# EAGLE schematic untitled (EAGLE 6.5.0)
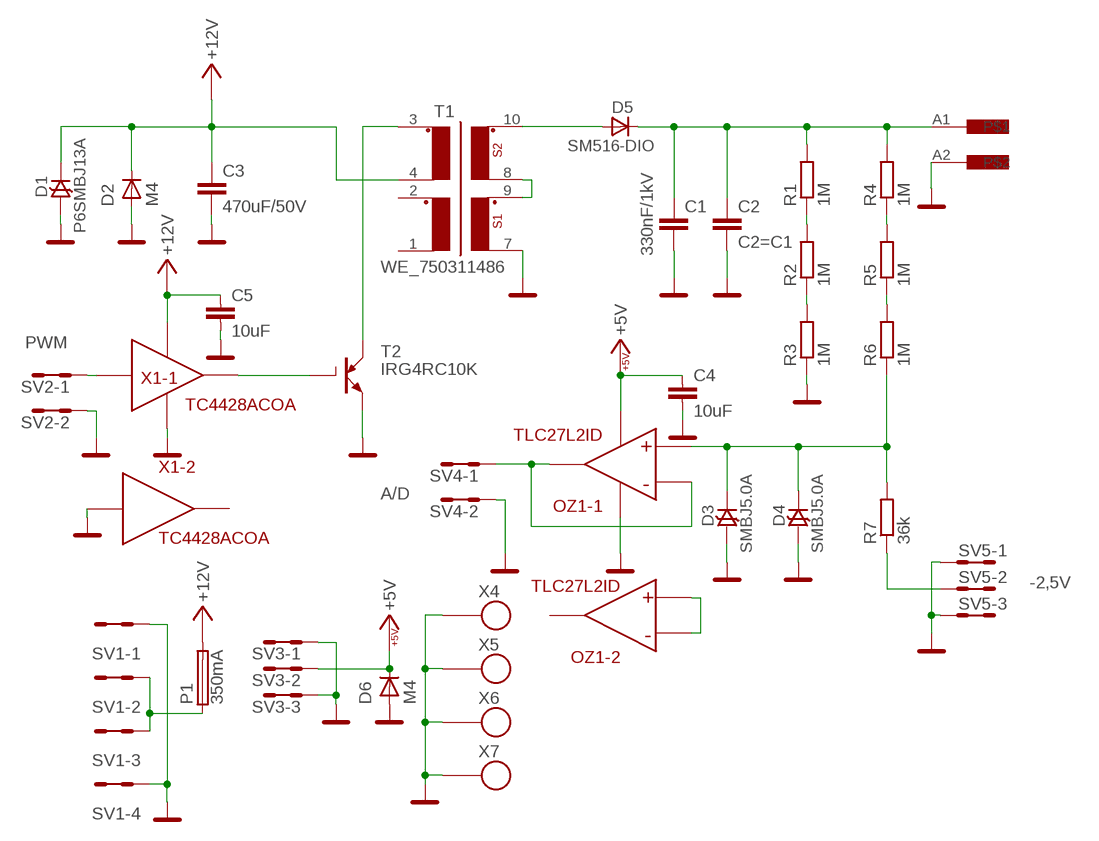
[diagram p0: schematic, sheet 1]

## Parts
C1  330nF/1kV  C-22,5MM  [C22,5MM]
C2  C2=C1  C-27,5MM  [C27,5MM]
C3  470uF/50V  C-EU050-025X075  [C050-025X075]
C4  10uF  C0805  [C0805]
C5  10uF  C0805  [C0805]
D1  P6SMBJ13A  D-TRANSIL  [SMB]
D2  M4  D-OB.SMA  [SMA]
D3  SMBJ5.0A  D-TRANSIL-SMA  [SMA]
D4  SMBJ5.0A  D-TRANSIL-SMA  [SMA]
D5  SM516-DIO  D-OB-MELF  [MELF]
D6  M4  D-OB.SMA  [SMA]
OZ1  TLC27L2ID  TLC27L2  [SOP8]
P1  350mA  POJISTKA_1812  [1812]
R1  1M  R1206  [1206]
R2  1M  R1206  [1206]
R3  1M  R1206  [1206]
R4  1M  R1206  [1206]
R5  1M  R1206  [1206]
R6  1M  R1206  [1206]
R7  36k  R0805  [0805]
SV1  MA04-2  [MA04-2]
SV2  MA02-2  [MA02-2]
SV3  MA03-2  [MA03-2]
SV4  MA02-2  [MA02-2]
SV5  MA03-2  [MA03-2]
T1  WE_750311486  TRAFO_WE_750311486  [TRAFO75311486]
T2  IRG4RC10K  IRG4RC10  [DPAK]
X1  TC4428ACOA  TC4428A  [SO8]
X2  SVORKOVNICE2X_PC  [SVORKOVNICE_10,16MM]
X4  SROUB3M  [SROUB3M]
X5  SROUB3M  [SROUB3M]
X6  SROUB3M  [SROUB3M]
X7  SROUB3M  [SROUB3M]

## Nets
+5V: C4.1 D6.K(C) OZ1.4(-1:GND) SV3.3 SV3.4
+12V: C3.1 C5.1 D1.K D2.K(C) P1.2 T1.4 X1.6(-1:VDD)
GND: C1.P$3 C2.P$2 C3.2 C4.2 C5.2 D1.A D2.A D3.A D4.A D6.A OZ1.8(-1:VDD) R3.1 SV1.1 SV1.2 SV1.7 SV1.8 SV2.3 SV2.4 SV3.1 SV3.2 SV3.5 SV3.6 SV4.3 SV4.4 SV5.1 SV5.2 SV5.5 SV5.6 T1.7 T2.S(E) X1.3(-1:GND) X1.4(-2:-) X2.A2 X4.P$1 X5.P$1 X6.P$1 X7.P$1
N$1: T1.3 T2.D(C)
N$2: T2.G X1.7(-1:VOUT)
N$4: SV2.1 SV2.2 X1.2(-1:-)
N$5: T1.8 T1.9
N$6: D5.A T1.10
N$7: C1.P$2 C2.P$1 D5.C(K) R1.2 R4.2 X2.A1
N$8: R1.1 R2.2
N$9: R2.1 R3.2
N$10: R4.1 R5.2
N$11: R5.1 R6.2
N$12: D3.K D4.K OZ1.3(-1:+) R6.1 R7.2
N$13: OZ1.1(-1:VOUT) OZ1.2(-1:-) SV4.1 SV4.2
N$14: P1.1 SV1.3 SV1.4 SV1.5 SV1.6
N$15: OZ1.5(-2:+) OZ1.6(-2:-)
N$16: R7.1 SV5.3 SV5.4
Unconnected: OZ1.7(-2:VOUT) T1.1 T1.2 X1.5(-2:VOUT)

## Notes on the sheet
- PWM
- A/D
- -2,5V

## Library data of the parts
C1 = moje:C-22,5MM
C2 = moje:C-27,5MM
C3 = rcl:C-EU: CAPACITOR, European symbol
C4 C5 = moje_C:C0805
D1 = moje_diody:D-TRANSIL: Trnasil SMB
D2 D6 = moje:D-OB.SMA: SMA
D3 D4 = moje_diody:D-TRANSIL-SMA
D5 = moje_diody:D-OB-MELF
OZ1 = moje_OZ:TLC27L2
P1 = moje:POJISTKA_1812: Pojistka s pouzdrem 1812
R1-R6 = moje_R:R1206
R7 = moje_R:R0805
SV1 = moje_hrebinky:MA04-2: PIN HEADER; OC_FARNELL: unknown; OC_NEWARK: unknown
SV2 SV4 = moje_hrebinky:MA02-2
SV3 SV5 = moje_hrebinky:MA03-2: PIN HEADER; OC_FARNELL: unknown; OC_NEWARK: unknown
T1 = moje:TRAFO_WE_750311486: Trafo WE 750311486
T2 = moje_T:IRG4RC10: IGBT N - DPAK
X1 = moje_io:TC4428A
X2 = moje:SVORKOVNICE2X_PC
X4-X7 = moje:SROUB3M